# EAGLE design bluetooth (EAGLE 9.7.0)
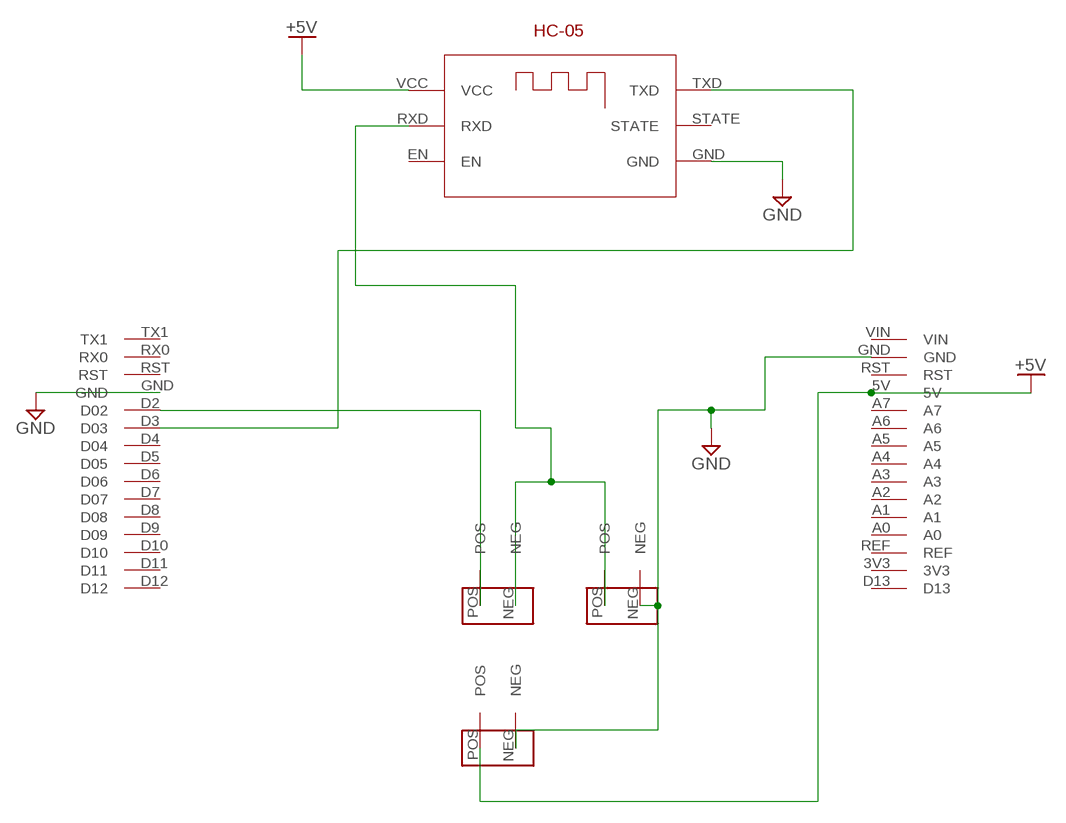
[diagram p0: schematic, sheet 1]

## Parts
POWER  CAP  [CAP]
U$1  ARDUINO-NANO-JUMPER-1  [ARDUINO-NANO-JUMPER-1]
U$2  ARDUINO-NANO-JUMPER-2  [ARDUINO-NANO-JUMPER-2]
U$3  RESISTOR  [RESISTOR]
U$4  RESISTOR  [RESISTOR]
U$5  HC-05  [HC-05]

## Nets
+5V: POWER.POS U$2.5V U$5.VCC
D02: U$1.D2(D02) U$3.POS
D03: U$1.D3(D03) U$5.TXD
GND: POWER.NEG U$1.GND U$2.GND U$4.NEG U$5.GND
RX: U$3.NEG U$4.POS U$5.RXD
Unconnected: U$1.D4(D04) U$1.D5(D05) U$1.D6(D06) U$1.D7(D07) U$1.D8(D08) U$1.D9(D09) U$1.D10 U$1.D11 U$1.D12 U$1.RST U$1.RX0 U$1.TX1 U$2.3V3 U$2.A0 U$2.A1 U$2.A2 U$2.A3 U$2.A4 U$2.A5 U$2.A6 U$2.A7 U$2.D13 U$2.REF U$2.RST U$2.VIN U$5.EN U$5.STATE

## Library data of the parts
POWER = RC Car:CAP
U$1 = RC Car:ARDUINO-NANO-JUMPER-1
U$2 = RC Car:ARDUINO-NANO-JUMPER-2
U$3 U$4 = rc_car:RESISTOR
U$5 = lib:HC-05

## Board
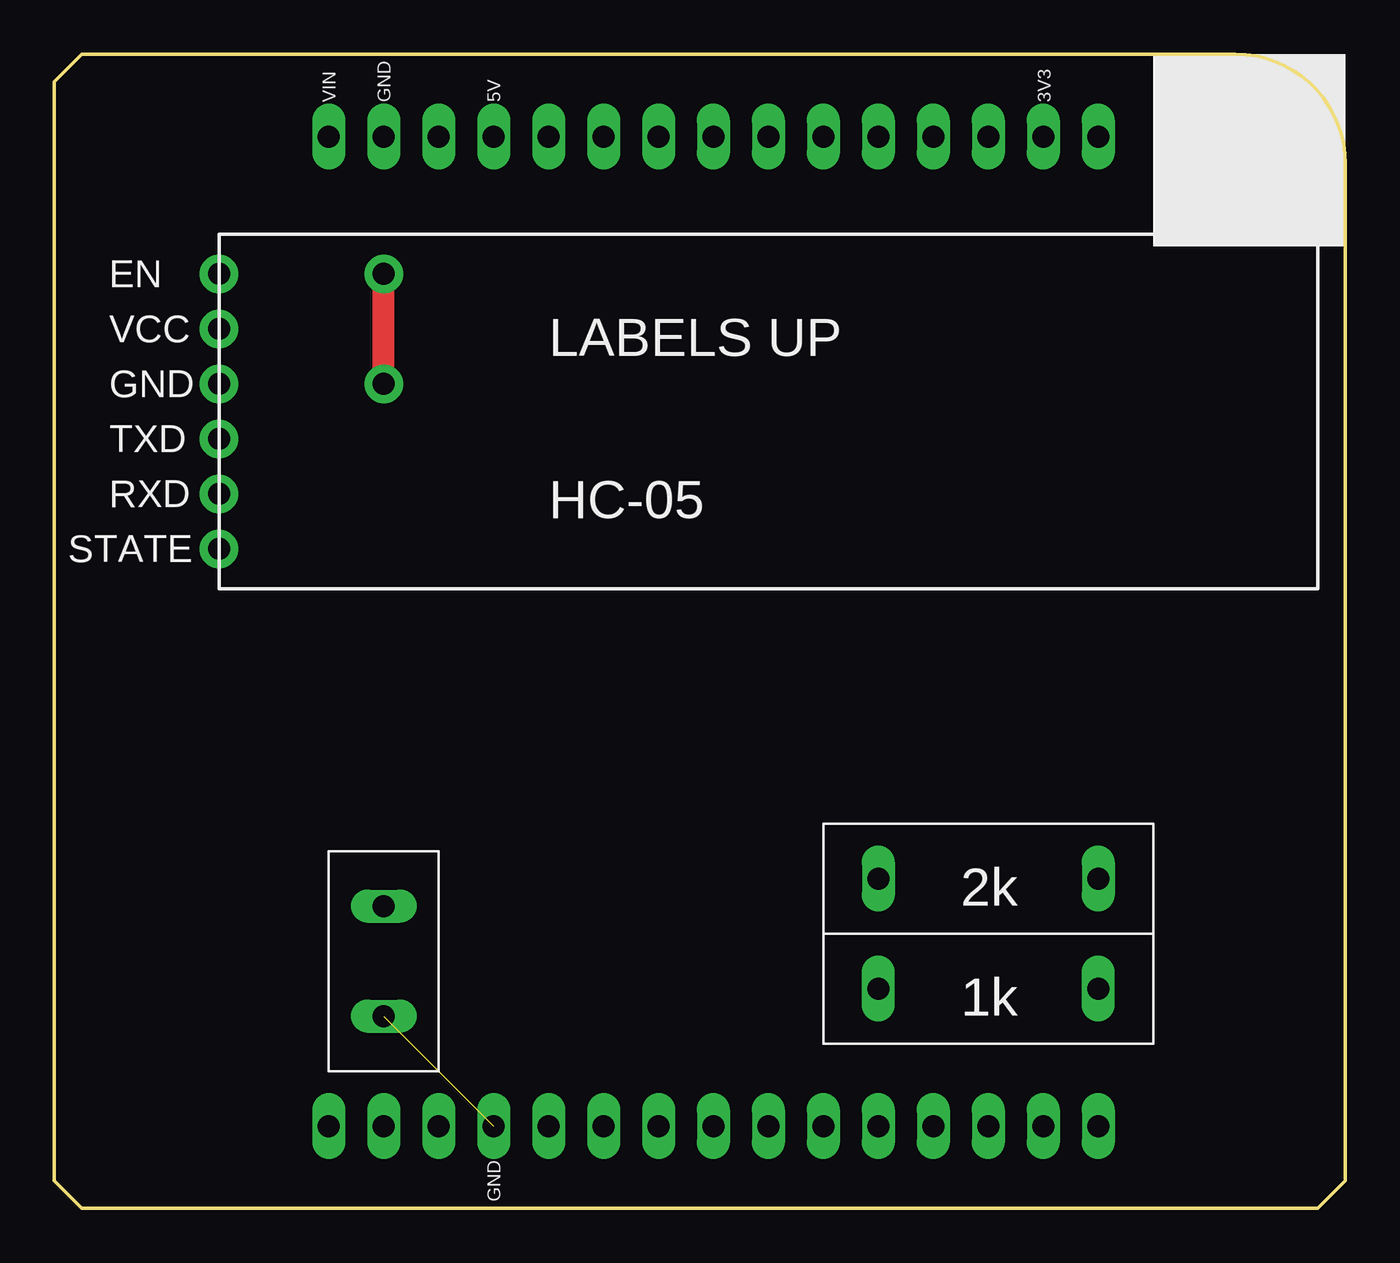
[diagram p1: board, top side]
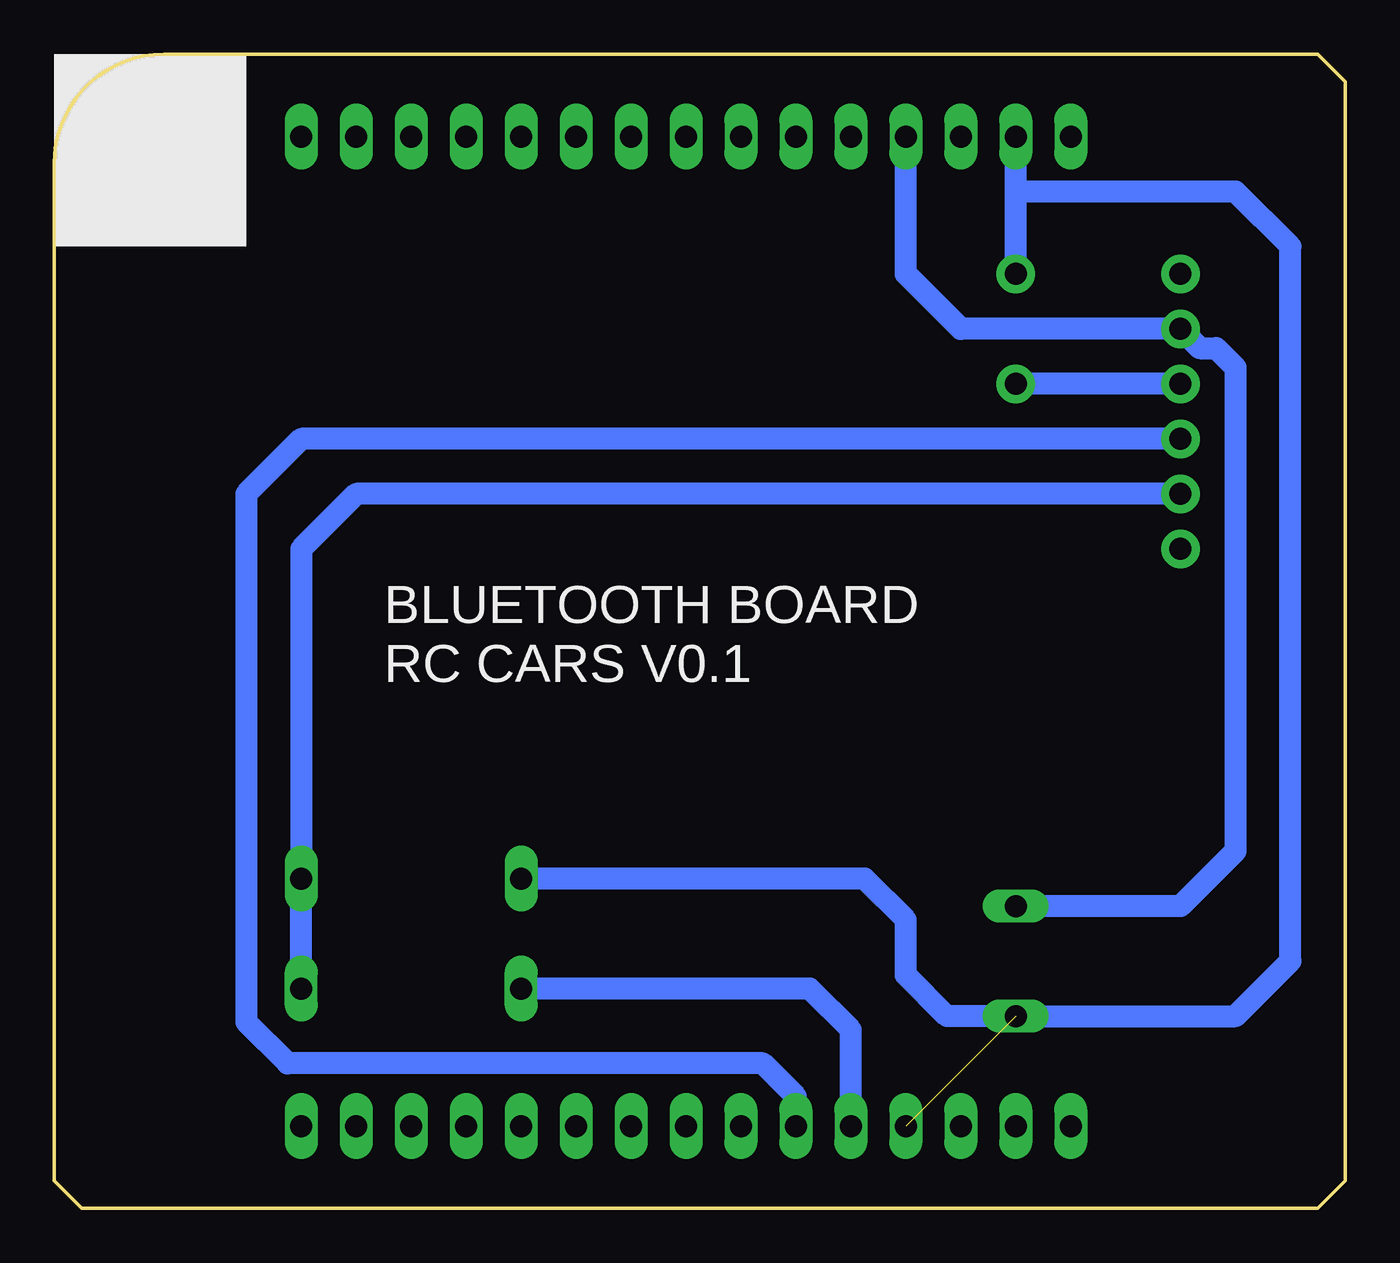
[diagram p2: board, bottom side, seen from below]

Size 59.69 x 53.34 mm. Coordinates in mm from the lower left corner, seen from the top.
Outline: 0,1.27 1.27,0 58.42,0 59.69,1.27 59.69,48.26 arc90 54.61,53.34 1.27,53.34 0,52.07 0,1.27
Copper layers (1*16): Top 0.035mm / dielectric 1.5mm / Bottom 0.035mm
Design rules "default": minimum track width 6mil, minimum drill 0.35mm, track to track 6mil, track to pad 6mil, pad to pad 6mil, via to via 6mil, smd to smd 6mil, copper to edge 40mil, drill to drill 6mil, minimum pad ring 10mil, minimum via ring 8mil, stop-mask expansion 4mil, vias tented up to drill 0mil, thermal gap 10mil

### Footprints (pad centres in the part's own frame; a part is rotated, then mirrored left to right if it is on the bottom)
CAP = drill 1.016 long: NEG 2.54,0; POS -2.54,0
ARDUINO-NANO-JUMPER-1 = drill 1.016 long: D2 7.62,0; D3 5.08,0; D4 2.54,0; D5 0,0; D6 -2.54,0; D7 -5.08,0; D8 -7.62,0; D9 -10.16,0; D10 -12.7,0; D11 -15.24,0; D12 -17.78,0; GND 10.16,0; RST 12.7,0; RX0 15.24,0; TX1 17.78,0
ARDUINO-NANO-JUMPER-2 = drill 1.016 long: 3V3 -15.24,0; 5V 10.16,0; A0 -10.16,0; A1 -7.62,0; A2 -5.08,0; A3 -2.54,0; A4 0,0; A5 2.54,0; A6 5.08,0; A7 7.62,0; D13 -17.78,0; GND 15.24,0; REF -12.7,0; RST 12.7,0; VIN 17.78,0
RESISTOR = drill 1.016 long: NEG 5.08,0; POS -5.08,0
HC-05 = drill 1.016 pad 1.778: EN -6.35,0; GND -1.27,0; RXD 3.81,0; STATE 6.35,0; TXD 1.27,0; VCC -3.81,0

### Placement (x,y rotation side)
POWER  15.24,11.43 270 top
U$1  30.48,3.81 180 top
U$2  30.48,49.53 180 top
U$3  43.18,10.16 0 top
U$4  43.18,15.24 180 top
U$5  7.62,36.83 270 top

### Tracks (layer width: path | path; a pad name or v marks a point on that pad's centre or on a via)
+5V
  Bottom 1.016: U$2.5V 20.32,43.18 17.78,40.64 U$5.VCC 6.73,39.75 5.97,39.75 5.08,38.86 5.08,16.51 7.62,13.97 POWER.POS
D02
  Bottom 1.016: U$1.D2 22.86,8.26 24.77,10.16 U$3.POS
D03
  Bottom 1.016: U$1.D3 25.4,5.18 26.92,6.71 48.9,6.71 50.8,8.61 50.8,33.02 48.26,35.56 U$5.TXD
GND  (via drill 1.02 pad 1.78)  (1 unrouted)
  Top 1.016: v15.24,38.1 v15.24,43.18
  Bottom 1.016: 15.24,46.99 U$2.GND | 15.24,46.99 5.08,46.99 2.54,44.45 2.54,11.43 5.08,8.89 POWER.NEG 18.41,8.89 20.32,10.79 20.32,13.34 22.23,15.24 U$4.NEG | U$5.GND v15.24,38.1 | v15.24,43.18 15.24,46.99
RX
  Bottom 1.016: U$3.NEG U$4.POS 48.26,30.48 45.72,33.02 U$5.RXD

### Text on the board
tPlace: VIN | GND | 5V | 3V3 | 2k | 1k | GND
bPlace: BLUETOOTH BOARD / RC CARS V0.1